# EAGLE schematic PX4FMUv1.7 (EAGLE 6.2)

## Sheet 1 of 3
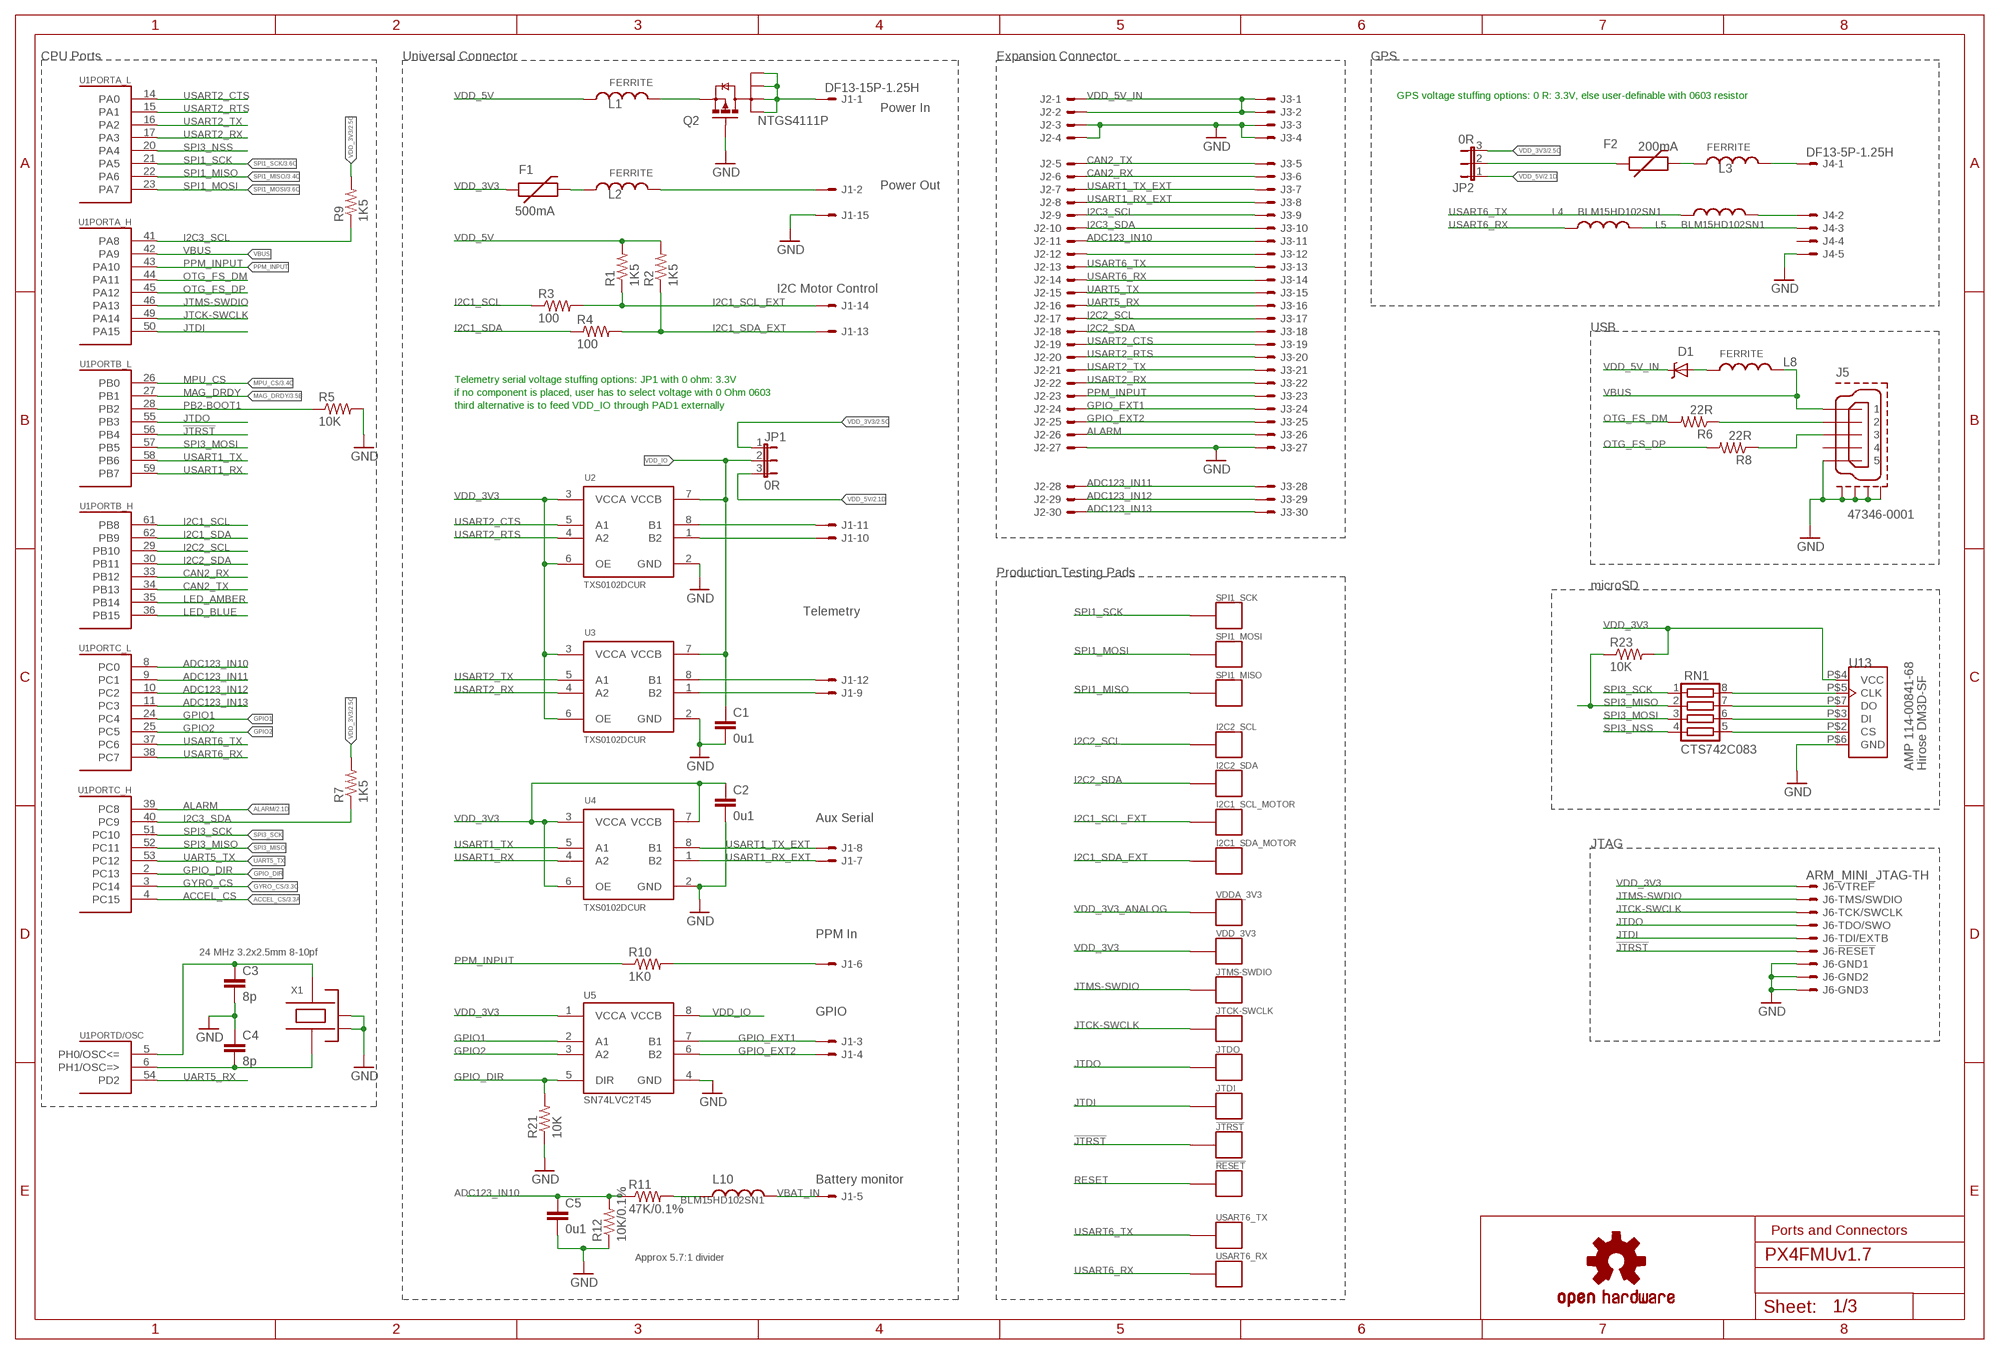
[diagram p0: schematic, sheet 1]

### Parts
!JTRST  PAD.04  [PAD.04X.04]
!RESET  PAD.04  [PAD.04X.04]
C1  0u1  CAP0402-CAP  [0402-CAP]
C2  0u1  CAP0402-CAP  [0402-CAP]
C3  8p  CAP0402-CAP  [0402-CAP]
C4  8p  CAP0402-CAP  [0402-CAP]
C5  0u1  CAP0402-CAP  [0402-CAP]
D1  MSS1P4-M3  DIODE-SCHOTTKY_MSMP  [MICROSMP]
F1  500mA  PTC0402  [0402-PTC]
F2  200mA  PTC0402  [0402-PTC]
I2C1_SCL_MOTOR  PAD.03  [PAD.03X.03]
I2C1_SDA_MOTOR  PAD.03  [PAD.03X.03]
I2C2_SCL  PAD.03  [PAD.03X.03]
I2C2_SDA  PAD.04  [PAD.04X.04]
J1  DF13-15P-1.25H  [DF13A-15P-1.25H]
J2  HEADER_2X15-REV  [HEADER_2MM_2X15_REVERSE]
J3  HEADER_2X15  HEADER_2X15-SMD  [HEADER_2MM_2X15]
J4  DF13-5P-1.25H  [DF13A-5P-1.25H]
J5  47346-0001  MOLEX-47346-0001  [MOLEX-47346-0001]
J6  ARM_MINI_JTAG-TH  [FTSH-105-01-XXX-DV]
JP1  0R  JUMPER-30603  [SJ_3_0603_PASTE1&2]
JP2  0R  JUMPER-30603  [SJ_3_0603_PASTE1&2]
JTCK-SWCLK  PAD.04  [PAD.04X.04]
JTDI  PAD.04  [PAD.04X.04]
JTDO  PAD.04  [PAD.04X.04]
JTMS-SWDIO  PAD.04  [PAD.04X.04]
L1  FERRITE  INDUCTOR0402  [0402-IND]
L2  FERRITE  INDUCTOR0402  [0402-IND]
L3  FERRITE  INDUCTOR0402  [0402-IND]
L4  BLM15HD102SN1  INDUCTOR0402  [0402-IND]
L5  BLM15HD102SN1  INDUCTOR0402  [0402-IND]
L8  FERRITE  INDUCTOR0402  [0402-IND]
L10  BLM15HD102SN1  INDUCTOR0402  [0402-IND]
Q2  NTGS4111P  [TSOP-6]
R1  1K5  RESISTOR0402-RES  [0402-RES]
R2  1K5  RESISTOR0402-RES  [0402-RES]
R3  100  RESISTOR0402-RES  [0402-RES]
R4  100  RESISTOR0402-RES  [0402-RES]
R5  10K  RESISTOR0402-RES  [0402-RES]
R6  22R  RESISTOR0402-RES  [0402-RES]
R7  1K5  RESISTOR0402-RES  [0402-RES]
R8  22R  RESISTOR0402-RES  [0402-RES]
R9  1K5  RESISTOR0402-RES  [0402-RES]
R10  1K0  RESISTOR0402-RES  [0402-RES]
R11  47K/0.1%  RESISTOR0402-RES  [0402-RES]
R12  10K/0.1%  RESISTOR0402-RES  [0402-RES]
R21  10K  RESISTOR0402-RES  [0402-RES]
R23  10K  RESISTOR0402-RES  [0402-RES]
RN1  CTS742C083  [CTS742C083]
SPI1_MISO  PAD.04  [PAD.04X.04]
SPI1_MOSI  PAD.04  [PAD.04X.04]
SPI1_SCK  PAD.04  [PAD.04X.04]
U1  STM32F405RGT6  STM32F20X_TQFP64  [TQFP64]
U2  TXS0102DCUR  [TI-DCU]
U3  TXS0102DCUR  [TI-DCU]
U4  TXS0102DCUR  [TI-DCU]
U5  SN74LVC2T45  SN74LVC2T45DCUR  [TI-DCU]
U13  AMP 114-00841-68  SF-MICROSDAMP-114-00841-68  [AMPHENOL_114-00841-68]
U$7  OSHW-LOGOS  [OSHW-LOGO-S]
USART6_RX  PAD.04  [PAD.04X.04]
USART6_TX  PAD.04  [PAD.04X.04]
VDD_3V3  PAD.04  [PAD.04X.04]
VDDA_3V3  PAD.04  [PAD.04X.04]
X1  24 MHz 3.2x2.5mm 8-10pf  OSCILLATOR-3.2X2.5  [OSCILLATOR-3.2X2.5]

### Nets
!JTRST: !JTRST.P$1 J6.10 U1.56(PORTB_L:PB4)
ACCEL_CS: U1.4(PORTC_H:PC15) ; also sheet 3
ADC123_IN10: C5.1 J2.11 J3.11 R11.1 R12.2 U1.8(PORTC_L:PC0)
ADC123_IN11: J2.28 J3.28 U1.9(PORTC_L:PC1)
ADC123_IN12: J2.29 J3.29 U1.10(PORTC_L:PC2)
ADC123_IN13: J2.30 J3.30 U1.11(PORTC_L:PC3) ; also sheet 3
ALARM: J2.26 J3.26 U1.39(PORTC_H:PC8) ; also sheet 2
CAN2_RX: J2.6 J3.6 U1.33(PORTB_H:PB12)
CAN2_TX: J2.5 J3.5 U1.34(PORTB_H:PB13)
GND [power]: C1.2 C2.2 C3.2 C4.1 C5.2 J1.15 J2.3 J2.4 J2.27 J3.3 J3.4 J3.27 J4.5 J5.GND J5.GND1 J5.GND2 J5.GND3 J5.GND4 J6.3 J6.5 J6.9 Q2.3(G) R5.2 R12.1 R21.1 U2.2(GND) U3.2(GND) U4.2(GND) U5.4(GND) U13.P$6(GND) X1.2(NC_2) X1.4(NC_4) ; also sheet 2,3
GPIO1: U1.24(PORTC_L:PC4) U5.2(A1)
GPIO2: U1.25(PORTC_L:PC5) U5.3(A2)
GPIO_DIR: R21.2 U1.2(PORTC_H:PC13) U5.5(DIR)
GPIO_EXT1: J1.3 J2.24 J3.24 U5.7(B1)
GPIO_EXT2: J1.4 J2.25 J3.25 U5.6(B2)
GYRO_CS: U1.3(PORTC_H:PC14) ; also sheet 3
I2C1_SCL: R3.1 U1.61(PORTB_H:PB8)
I2C1_SCL_EXT: I2C1_SCL_MOTOR.P$1 J1.14 R1.1 R3.2
I2C1_SDA: R4.1 U1.62(PORTB_H:PB9)
I2C1_SDA_EXT: I2C1_SDA_MOTOR.P$1 J1.13 R2.1 R4.2
I2C2_SCL: I2C2_SCL.P$1 J2.17 J3.17 U1.29(PORTB_H:PB10) ; also sheet 2,3
I2C2_SDA: I2C2_SDA.P$1 J2.18 J3.18 U1.30(PORTB_H:PB11) ; also sheet 2,3
I2C3_SCL: J2.9 J3.9 R9.1 U1.41(PORTA_H:PA8)
I2C3_SDA: J2.10 J3.10 R7.1 U1.40(PORTC_H:PC9)
JTCK-SWCLK: J6.4 JTCK-SWCLK.P$1 U1.49(PORTA_H:PA14)
JTDI: J6.8 JTDI.P$1 U1.50(PORTA_H:PA15)
JTDO: J6.6 JTDO.P$1 U1.55(PORTB_L:PB3)
JTMS-SWDIO: J6.2 JTMS-SWDIO.P$1 U1.46(PORTA_H:PA13)
LED_AMBER: U1.35(PORTB_H:PB14) ; also sheet 2
LED_BLUE: U1.36(PORTB_H:PB15) ; also sheet 2
MAG_DRDY: U1.27(PORTB_L:PB1) ; also sheet 3
MPU_CS: U1.26(PORTB_L:PB0) ; also sheet 3
N$1: C4.2 U1.6(PORTD/OSC:PH1/OSC=>) X1.1
N$2: C3.1 U1.5(PORTD/OSC:PH0/OSC<=) X1.3
N$3: J1.2 L2.2
N$5: F2.2 L3.1
N$8: J4.2 L5.2
N$11: J4.3 L4.2
N$12: J1.11 U2.8(B1)
N$13: J1.10 U2.1(B2)
N$14: L1.2 Q2.4(S)
N$15: J1.12 U3.8(B1)
N$16: J1.9 U3.1(B2)
N$18: F2.1 JP2.2
N$20: J2.12 J3.12
N$21: RN1.5 U13.P$2(CS)
N$23 [power]: D1.ANODE(A) L8.1
N$24 [power]: J4.1 L3.2
N$26: RN1.6 U13.P$3(DI)
N$27 [power]: F1.2 L2.1
N$31: RN1.7 U13.P$7(DO)
N$32: RN1.8 U13.P$5(CLK)
N$35: L10.1 R11.2
N$41: J1.1 Q2.1(D) Q2.2(D1) Q2.5(D2) Q2.6(D3)
OTG_DM: J5.D- R6.1
OTG_DP: J5.D+ R8.1
OTG_FS_DM: R6.2 U1.44(PORTA_H:PA11)
OTG_FS_DP: R8.2 U1.45(PORTA_H:PA12)
PB2-BOOT1: R5.1 U1.28(PORTB_L:PB2)
PPM_INPUT: J2.23 J3.23 R10.1 U1.43(PORTA_H:PA10)
PPM_INPUT_CON: J1.6 R10.2
RESET: !RESET.P$1 ; also sheet 2
SPI1_MISO: SPI1_MISO.P$1 U1.22(PORTA_L:PA6) ; also sheet 3
SPI1_MOSI: SPI1_MOSI.P$1 U1.23(PORTA_L:PA7) ; also sheet 3
SPI1_SCK: SPI1_SCK.P$1 U1.21(PORTA_L:PA5) ; also sheet 3
SPI3_MISO: R23.1 RN1.2 U1.52(PORTC_H:PC11)
SPI3_MOSI: RN1.3 U1.57(PORTB_L:PB5)
SPI3_NSS: RN1.4 U1.20(PORTA_L:PA4)
SPI3_SCK: RN1.1 U1.51(PORTC_H:PC10)
UART5_RX: J2.16 J3.16 U1.54(PORTD/OSC:PD2)
UART5_TX: J2.15 J3.15 U1.53(PORTC_H:PC12)
USART1_RX: U1.59(PORTB_L:PB7) U4.4(A2)
USART1_RX_EXT: J1.7 J2.8 J3.8 U4.1(B2)
USART1_TX: U1.58(PORTB_L:PB6) U4.5(A1)
USART1_TX_EXT: J1.8 J2.7 J3.7 U4.8(B1)
USART2_CTS: J2.19 J3.19 U1.14(PORTA_L:PA0) U2.5(A1)
USART2_RTS: J2.20 J3.20 U1.15(PORTA_L:PA1) U2.4(A2)
USART2_RX: J2.22 J3.22 U1.17(PORTA_L:PA3) U3.4(A2)
USART2_TX: J2.21 J3.21 U1.16(PORTA_L:PA2) U3.5(A1)
USART6_RX: J2.14 J3.14 L4.1 U1.38(PORTC_L:PC7) USART6_RX.P$1
USART6_TX: J2.13 J3.13 L5.1 U1.37(PORTC_L:PC6) USART6_TX.P$1
VBAT_IN: J1.5 L10.2 ; also sheet 2
VBUS [power]: J5.VBUS L8.2 U1.42(PORTA_H:PA9)
VDD_3V3 [power]: C2.1 F1.1 J6.1 JP1.1 JP2.3 R7.2 R9.2 R23.2 U2.3(VCCA) U2.6(OE) U3.3(VCCA) U3.6(OE) U4.3(VCCA) U4.6(OE) U4.7(VCCB) U5.1(VCCA) U13.P$4(VCC) VDD_3V3.P$1 ; also sheet 2,3
VDD_3V3_ANALOG [power]: VDDA_3V3.P$1 ; also sheet 2,3
VDD_5V [power]: JP1.3 JP2.1 L1.1 R1.2 R2.2 ; also sheet 2
VDD_5V_IN [power]: D1.CATHODE(C) J2.1 J2.2 J3.1 J3.2 ; also sheet 2
VDD_IO [power]: C1.1 JP1.2 U2.7(VCCB) U3.7(VCCB) U5.8(VCCB)
Unconnected: J4.4 J5.ID

### Notes on the sheet
- CPU Ports | Universal Connector | Expansion Connector | GPS
- GPS voltage stuffing options: 0 R: 3.3V, else user-definable with 0603 resistor
- Power In
- Power Out
- I2C Motor Control
- USB
- Telemetry serial voltage stuffing options: JP1 with 0 ohm: 3.3V
- if no component is placed, user has to select voltage with 0 Ohm 0603
- third alternative is to feed VDD_IO through PAD1 externally
- Production Testing Pads
- microSD
- Telemetry
- Hirose DM3D-SF
- Aux Serial
- JTAG
- PPM In
- GPIO
- Battery monitor
- Ports and Connectors
- Approx 5.7:1 divider

## Sheet 2 of 3
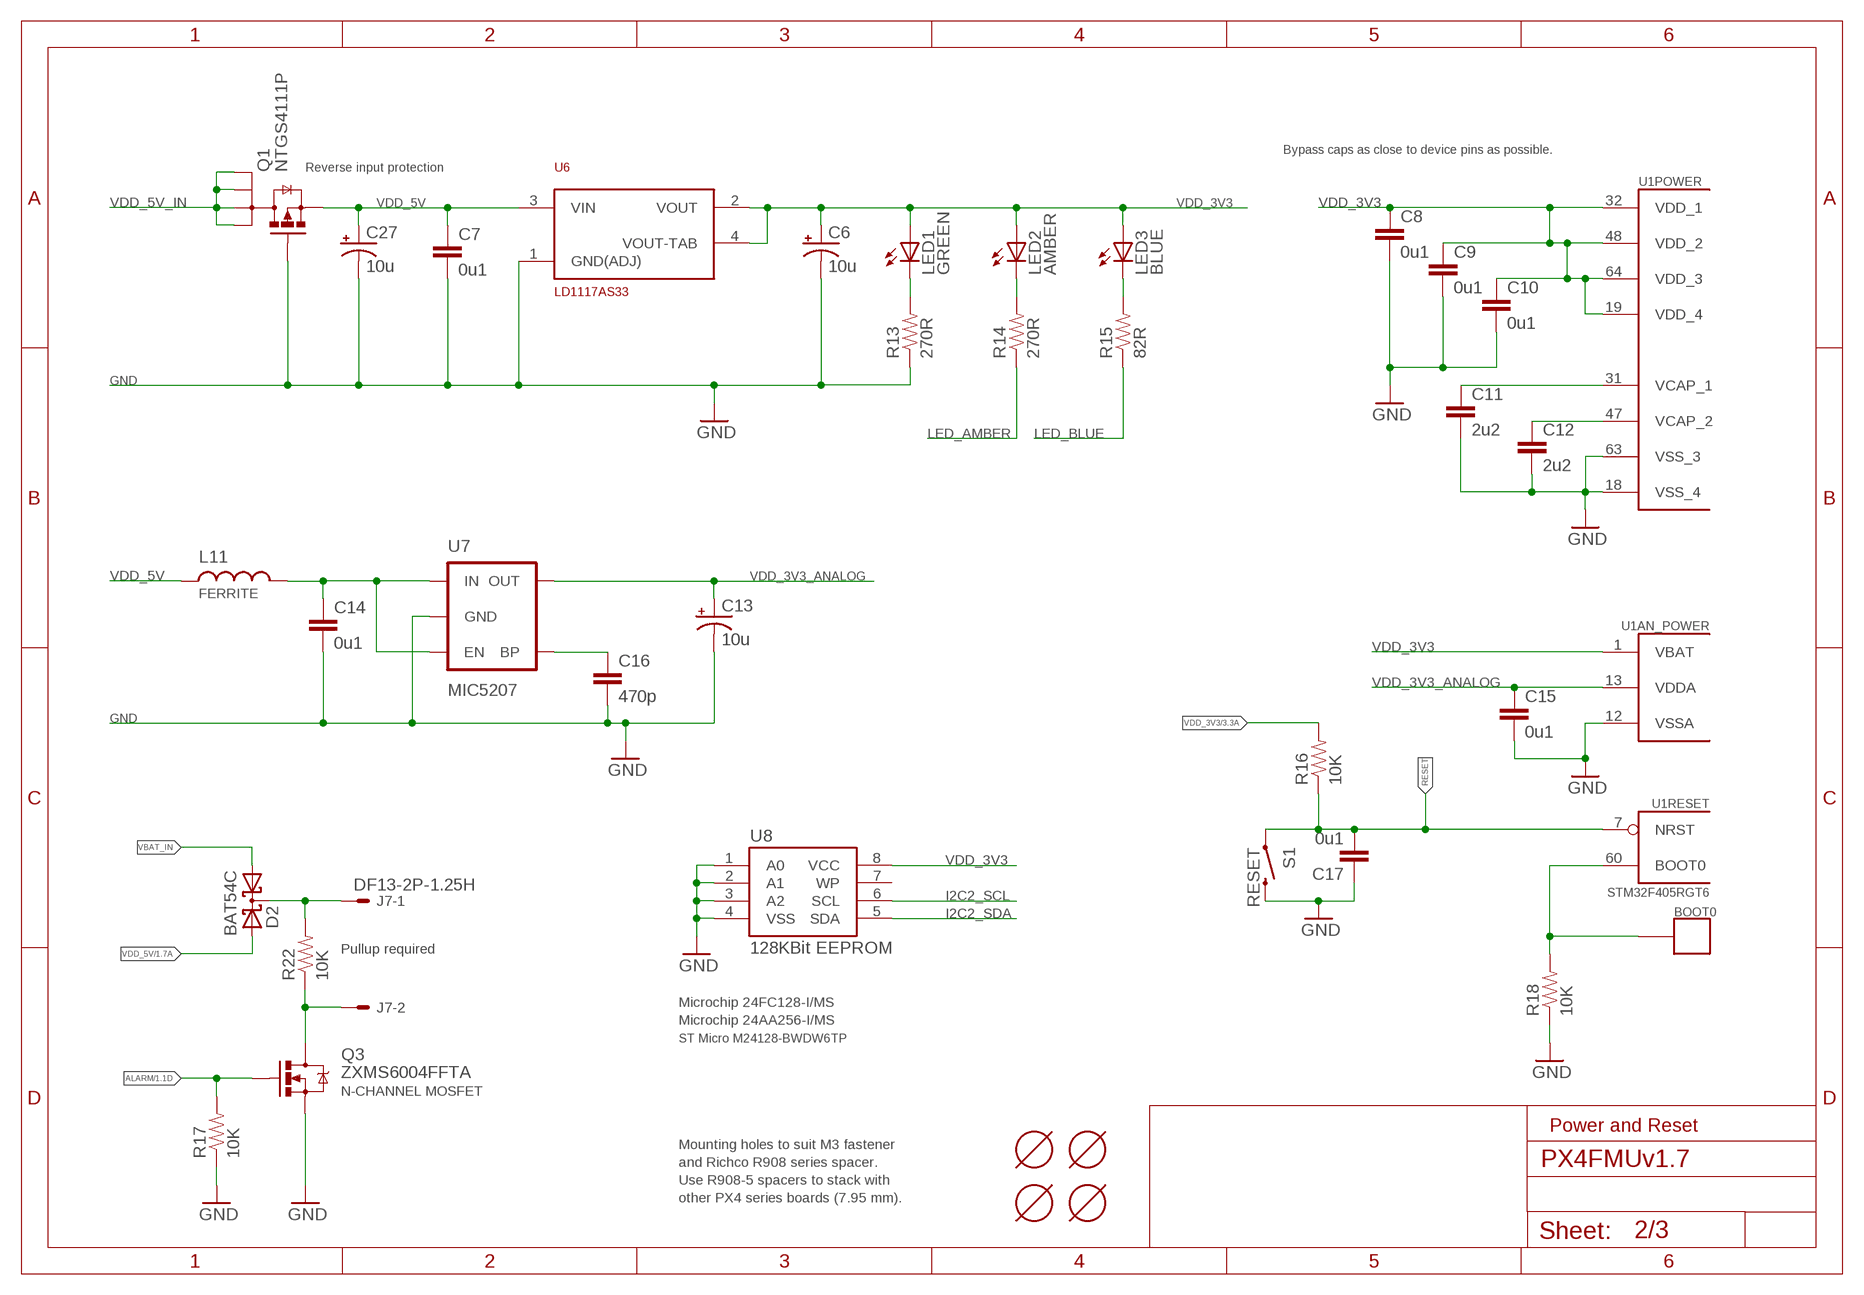
[diagram p1: schematic, sheet 2]

### Parts
BOOT0  PAD.04  [PAD.04X.04]
C6  10u  CAP_POL1206  [EIA3216]
C7  0u1  CAP0402-CAP  [0402-CAP]
C8  0u1  CAP0402-CAP  [0402-CAP]
C9  0u1  CAP0402-CAP  [0402-CAP]
C10  0u1  CAP0402-CAP  [0402-CAP]
C11  2u2  CAP0402-CAP  [0402-CAP]
C12  2u2  CAP0402-CAP  [0402-CAP]
C13  10u  CAP_POL1206  [EIA3216]
C14  0u1  CAP0402-CAP  [0402-CAP]
C15  0u1  CAP0402-CAP  [0402-CAP]
C16  470p  CAP0402-CAP  [0402-CAP]
C17  0u1  CAP0402-CAP  [0402-CAP]
C27  10u  CAP_POL1206  [EIA3216]
D2  BAT54C  [SOT23-3]
J7  DF13-2P-1.25H  [DF13A-2P-1.25H]
L11  FERRITE  INDUCTOR0402  [0402-IND]
LED1  GREEN  LED0603  [LED-0603]
LED2  AMBER  LED0603  [LED-0603]
LED3  BLUE  LED0603  [LED-0603]
Q1  NTGS4111P  [TSOP-6]
Q3  ZXMS6004FFTA  MOSFET-NCHANNELSMD  [SOT23-3]
R13  270R  RESISTOR0402-RES  [0402-RES]
R14  270R  RESISTOR0402-RES  [0402-RES]
R15  82R  RESISTOR0402-RES  [0402-RES]
R16  10K  RESISTOR0402-RES  [0402-RES]
R17  10K  RESISTOR0402-RES  [0402-RES]
R18  10K  RESISTOR0402-RES  [0402-RES]
R22  10K  RESISTOR0402-RES  [0402-RES]
S1  RESET  SWITCH-MOMENTARY-2  [EVQP7J01K]
U6  LD1117AS33  [SOT-223]
U7  MIC5207  V_REG_LDOSMD  [SOT23-5]
U8  128KBit EEPROM  EEPROM-I2CMSOP  [MSOP-8]
U$1  MOUNT-HOLE3.1MM  [MOUNT-HOLE3.1]
U$2  MOUNT-HOLE3.1MM  [MOUNT-HOLE3.1]
U$3  MOUNT-HOLE3.1MM  [MOUNT-HOLE3.1]
U$4  MOUNT-HOLE3.1MM  [MOUNT-HOLE3.1]

### Nets
ALARM: Q3.1(G) R17.2 ; also sheet 1
BOOT0: BOOT0.P$1 R18.2 U1.60(RESET:BOOT0)
GND [power]: C6.C(-) C7.2 C8.2 C9.2 C10.2 C11.2 C12.2 C13.C(-) C14.2 C15.2 C16.2 C17.1 C27.C(-) Q1.3(G) Q3.2(S) R13.1 R17.1 R18.1 S1.B3 U1.12(AN_POWER:VSSA) U1.18(POWER:VSS_4) U1.63(POWER:VSS_3) U6.1(GND(ADJ)) U7.2(GND) U8.1(A0) U8.2(A1) U8.3(A2) U8.4(VSS) ; also sheet 1,3
I2C2_SCL: U8.6(SCL) ; also sheet 1,3
I2C2_SDA: U8.5(SDA) ; also sheet 1,3
LED_AMBER: R14.1 ; also sheet 1
LED_BLUE: R15.1 ; also sheet 1
N$4: D2.3(CC) J7.1 R22.2
N$9: C16.1 U7.4(BP)
N$25: J7.2 Q3.3(D) R22.1
N$28: LED3.C R15.2
N$29: LED1.C R13.2
N$30: LED2.C R14.2
N$100 [power]: C14.1 L11.2 U7.1(IN) U7.3(EN)
RESET: C17.2 R16.1 S1.A1 U1.7(RESET:NRST) ; also sheet 1
VBAT_IN: D2.1(A1) ; also sheet 1
VCAP_1: C11.1 U1.31(POWER:VCAP_1)
VCAP_2: C12.1 U1.47(POWER:VCAP_2)
VDD_3V3 [power]: C6.A(+) C8.1 C9.1 C10.1 LED1.A LED2.A LED3.A R16.2 U1.1(AN_POWER:VBAT) U1.19(POWER:VDD_4) U1.32(POWER:VDD_1) U1.48(POWER:VDD_2) U1.64(POWER:VDD_3) U6.2(VOUT) U6.4(VOUT-TAB) U8.8(VCC) ; also sheet 1,3
VDD_3V3_ANALOG [power]: C13.A(+) C15.1 U1.13(AN_POWER:VDDA) U7.5(OUT) ; also sheet 1,3
VDD_5V [power]: C7.1 C27.A(+) D2.2(A2) L11.1 Q1.4(S) U6.3(VIN) ; also sheet 1
VDD_5V_IN [power]: Q1.1(D) Q1.2(D1) Q1.5(D2) Q1.6(D3) ; also sheet 1
Unconnected: U8.7(WP)

### Notes on the sheet
- Bypass caps as close to device pins as possible.
- Reverse input protection
- Pullup required
- Microchip 24FC128-I/MS
- Microchip 24AA256-I/MS
- ST Micro M24128-BWDW6TP
- N-CHANNEL MOSFET
- Power and Reset
- Mounting holes to suit M3 fastener
- and Richco R908 series spacer.
- Use R908-5 spacers to stack with
- other PX4 series boards (7.95 mm).

## Sheet 3 of 3
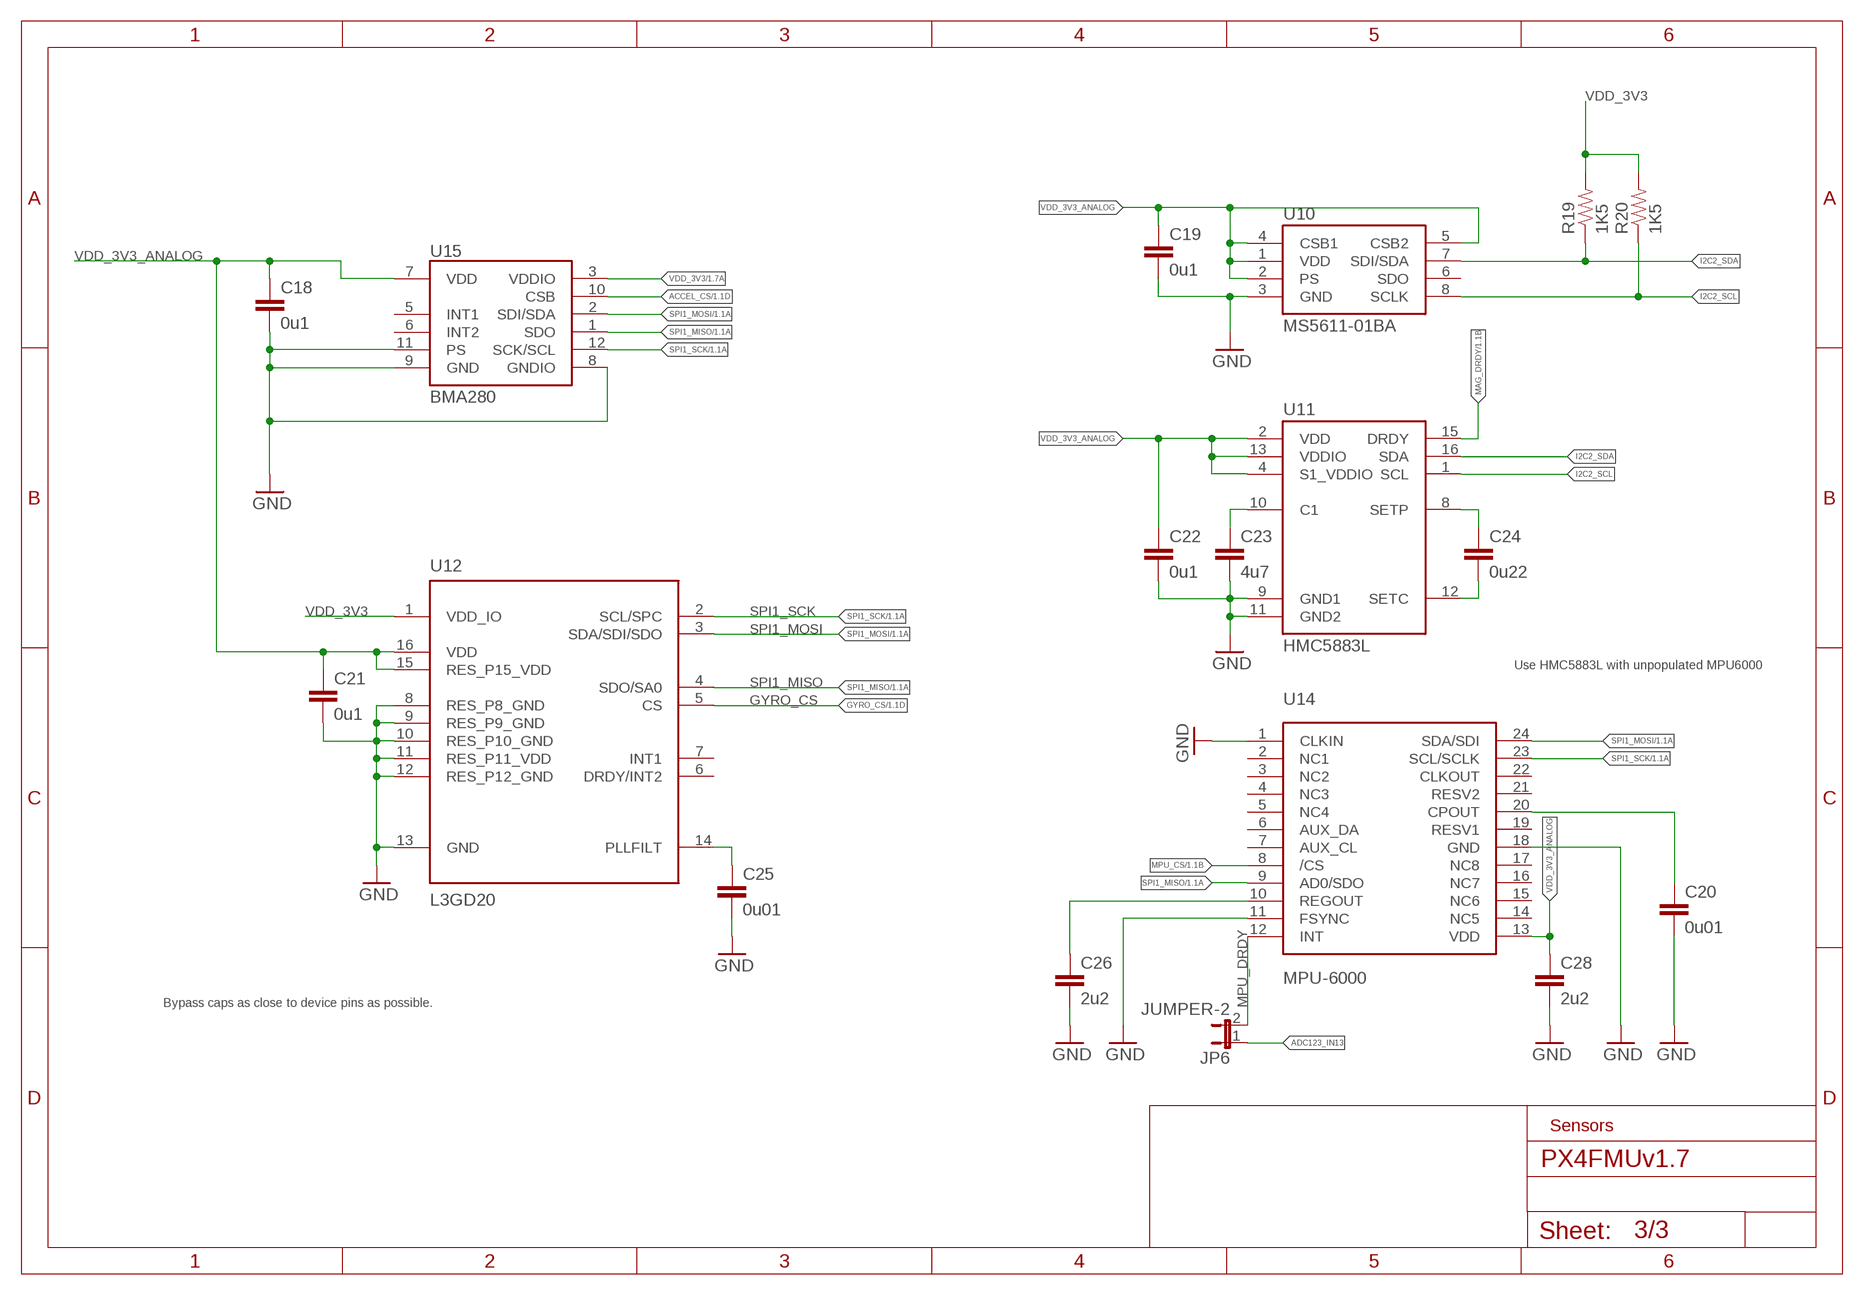
[diagram p2: schematic, sheet 3]

### Parts
C18  0u1  CAP0402-CAP  [0402-CAP]
C19  0u1  CAP0402-CAP  [0402-CAP]
C20  0u01  CAP0402-CAP  [0402-CAP]
C21  0u1  CAP0402-CAP  [0402-CAP]
C22  0u1  CAP0402-CAP  [0402-CAP]
C23  4u7  CAP0402-CAP  [0402-CAP]
C24  0u22  CAP0402-CAP  [0402-CAP]
C25  0u01  CAP0402-CAP  [0402-CAP]
C26  2u2  CAP0402-CAP  [0402-CAP]
C28  2u2  CAP0402-CAP  [0402-CAP]
JP6  JUMPER-2  [SJ_2]
R19  1K5  RESISTOR0402-RES  [0402-RES]
R20  1K5  RESISTOR0402-RES  [0402-RES]
U10  MS5611-01BA  [MS5611-01BA]
U11  HMC5883L  [HMC5883L-MAN]
U12  L3GD20  L3G4200DH-LL  [L3G4200DH-MAN]
U14  MPU-6000  [QFN-24]
U15  BMA280  [BMA280]

### Nets
ACCEL_CS: U15.10(CSB) ; also sheet 1
ADC123_IN13: JP6.1 ; also sheet 1
GND [power]: C18.2 C19.2 C20.2 C21.2 C22.2 C23.2 C25.2 C26.2 C28.2 U10.3(GND) U11.9(GND1) U11.11(GND2) U12.8(RES_P8_GND) U12.9(RES_P9_GND) U12.10(RES_P10_GND) U12.11(RES_P11_VDD) U12.12(RES_P12_GND) U12.13(GND) U14.1(CLKIN) U14.11(FSYNC) U14.18(GND) U15.8(GNDIO) U15.9(GND) U15.11(PS) ; also sheet 1,2
GYRO_CS: U12.5(CS) ; also sheet 1
I2C2_SCL: R20.1 U10.8(SCLK) U11.1(SCL) ; also sheet 1,2
I2C2_SDA: R19.1 U10.7(SDI/SDA) U11.16(SDA) ; also sheet 1,2
MAG_DRDY: U11.15(DRDY) ; also sheet 1
MPU_CS: U14.8(/CS) ; also sheet 1
N$10: C24.1 U11.8(SETP)
N$17: C24.2 U11.12(SETC)
N$34: C25.1 U12.14(PLLFILT)
N$36: C23.1 U11.10(C1)
N$40: C20.1 U14.20(CPOUT)
N$42: C26.1 U14.10(REGOUT)
N$44: JP6.2 U14.12(INT)
SPI1_MISO: U12.4(SDO/SA0) U14.9(AD0/SDO) U15.1(SDO) ; also sheet 1
SPI1_MOSI: U12.3(SDA/SDI/SDO) U14.24(SDA/SDI) U15.2(SDI/SDA) ; also sheet 1
SPI1_SCK: U12.2(SCL/SPC) U14.23(SCL/SCLK) U15.12(SCK/SCL) ; also sheet 1
VDD_3V3 [power]: R19.2 R20.2 U12.1(VDD_IO) U15.3(VDDIO) ; also sheet 1,2
VDD_3V3_ANALOG [power]: C18.1 C19.1 C21.1 C22.1 C28.1 U10.1(VDD) U10.2(PS) U10.4(CSB1) U10.5(CSB2) U11.2(VDD) U11.4(S1_VDDIO) U11.13(VDDIO) U12.15(RES_P15_VDD) U12.16(VDD) U14.13(VDD) U15.7(VDD) ; also sheet 1,2
Unconnected: U10.6(SDO) U11.3(NC_P3) U11.5(NC_P5) U11.6(NC_P6) U11.7(NC_P7) U11.14(NC_P14) U12.6(DRDY/INT2) U12.7(INT1) U14.2(NC1) U14.3(NC2) U14.4(NC3) U14.5(NC4) U14.6(AUX_DA) U14.7(AUX_CL) U14.14(NC5) U14.15(NC6) U14.16(NC7) U14.17(NC8) U14.19(RESV1) U14.21(RESV2) U14.22(CLKOUT) U15.5(INT1) U15.6(INT2)

### Notes on the sheet
- Use HMC5883L with unpopulated MPU6000
- Bypass caps as close to device pins as possible. | MPU_DRDY
- Sensors

## Library data of the parts
!JTRST !RESET BOOT0 I2C1_SCL_MOTOR I2C1_SDA_MOTOR I2C2_SCL I2C2_SDA JTCK-SWCLK JTDI JTDO JTMS-SWDIO SPI1_MISO SPI1_MOSI SPI1_SCK USART6_RX USART6_TX VDD_3V3 VDDA_3V3 = pixhawk2:PAD: Test pad This footprint includes three classes: The actual test pads, a pogo-pin footprint to mount the pogo-pin as through-hole part and a hole footprint which allows the head of the pogo-pin to pass through (do NOT use the hole to mount the pogo-pin). In a typical test setup, the stack would consist of three PCBs: The actual PCB under testing with a test pad on the bottom, then a second PCB with the hole for the pogo-pin head where the PCB under testing is pressed on and a third PCB at 30 mm / 1.2" distance with the pogo-pin footprints. The pogo-pins are soldered to the last PCB. To create the stack, copy the board under testing and exchange the footprints - this way the correct positioning is ensured.; BOM: EXCLUDE; PARTNO: *
C1 C2 C5 C7-C10 C14 C15 C17-C19 C21 C22 = pixhawk2:CAP: Capacitor Standard 0603 ceramic capacitor, and 0.1" leaded capacitor.; PARTNO: CC0402ZRY5V7BB104
C3 C4 = pixhawk2:CAP: Capacitor Standard 0603 ceramic capacitor, and 0.1" leaded capacitor.; PARTNO: C1005C0G1H080C
C6 C13 C27 = pixhawk2:CAP_POL: Capacitor Polarized These are standard SMD and PTH capacitors. Normally 10uF, 47uF, and 100uF in electrolytic and tantalum varieties. Always verify the external diameter of the through hole cap, it varies with capacity, voltage, and manufacturer. The EIA devices should be standard.; PARTNO: F931A106MAA
C11 C12 C26 C28 = pixhawk2:CAP: Capacitor Standard 0603 ceramic capacitor, and 0.1" leaded capacitor.; PARTNO: C1608Y5V1C225Z
C16 = pixhawk2:CAP: Capacitor Standard 0603 ceramic capacitor, and 0.1" leaded capacitor.; PARTNO: CC0402KRX7R9BB471
C20 C25 = pixhawk2:CAP: Capacitor Standard 0603 ceramic capacitor, and 0.1" leaded capacitor.; PARTNO: CC0402KRX7R7BB103
C23 = pixhawk2:CAP: Capacitor Standard 0603 ceramic capacitor, and 0.1" leaded capacitor.; PARTNO: C1608Y5V0J475Z
C24 = pixhawk2:CAP: Capacitor Standard 0603 ceramic capacitor, and 0.1" leaded capacitor.; PARTNO: C1005Y5V1C224Z
D1 = pixhawk2:DIODE-SCHOTTKY: Schottky barrier diode in DO214AC, e.g. Fairchild SS14.; PARTNO: MSS1P4-M3/89A
D2 = pixhawk2:BAT54C: Schottky Diodes Source: Fairchild .. BAT54.pdf; PARTNO: BAT54C-7-F
F1 = pixhawk2:PTC: Resettable Fuse PTC Resettable Fuse. Spark Fun Electronics SKU : COM-08357; PARTNO: MF-FSMF050X-2
F2 = pixhawk2:PTC: Resettable Fuse PTC Resettable Fuse. Spark Fun Electronics SKU : COM-08357; PARTNO: MF-FSMF020X-2
J1 = pixhawk2:DF13-15P-1.25?; PARTNO: DF13A-15P-1.25H(20)
J2 = pixhawk2:HEADER_2X15: 2X15 header; BOM: EXCLUDE; PARTNO: 953230-2000-AR-PR
J3 = pixhawk2:HEADER_2X15: 2X15 header; PARTNO: 953230-2000-AR-PR
J4 = pixhawk2:DF13-5P-1.25?; PARTNO: DF13A-5P-1.25H(20)
J5 = pixhawk2:MOLEX-47346-0001: MICRO USB B, BOTTOM MOUNT; PARTNO: 47346-0001
J6 = pixhawk2:ARM_MINI_JTAG: CONNECTOR wire to board 1.25 mm (.049 inch) pitch header; PARTNO: M50-3900542
J7 = pixhawk2:DF13-2P-1.25?; PARTNO: DF13-2P-1.25H(20)
JP1 JP2 = pixhawk2:JUMPER-3; PARTNO: RMCF0402ZT0R00
JP6 = pixhawk2:JUMPER-2; BOM: EXCLUDE
L1-L3 L8 L11 = pixhawk2:INDUCTOR: Inductors Basic Inductor/Choke - 0603 and 1206. Footprints are not proven and vary greatly between part numbers.; PARTNO: BKP1005HS121-T
L4 L5 L10 = pixhawk2:INDUCTOR: Inductors Basic Inductor/Choke - 0603 and 1206. Footprints are not proven and vary greatly between part numbers.; PARTNO: BLM15HD102SN1
LED1 = pixhawk2:LED: LEDs Standard schematic elements and footprints for 5mm, 3mm, 1206, and 0603 sized LEDs. 5mm - Spark Fun Electronics SKU : COM-00529 (and others); PARTNO: LNJ337W83RA
LED2 = pixhawk2:LED: LEDs Standard schematic elements and footprints for 5mm, 3mm, 1206, and 0603 sized LEDs. 5mm - Spark Fun Electronics SKU : COM-00529 (and others); PARTNO: LNJ437W84RA
LED3 = pixhawk2:LED: LEDs Standard schematic elements and footprints for 5mm, 3mm, 1206, and 0603 sized LEDs. 5mm - Spark Fun Electronics SKU : COM-00529 (and others); PARTNO: LNJ937W8CRA
Q1 Q2 = pixhawk2:NTGS4111P; PARTNO: NTGS4111P
Q3 = pixhawk2:MOSFET-NCHANNEL; PARTNO: ZXMS6004FFTA
R1 R2 R7 R9 R19 R20 = pixhawk2:RESISTOR: Resistor Basic schematic elements and footprints for 0603, 1206, and PTH 1/10th watt (small) resistors.; PARTNO: RMCF0402JT1K50
R3 R4 = pixhawk2:RESISTOR: Resistor Basic schematic elements and footprints for 0603, 1206, and PTH 1/10th watt (small) resistors.; PARTNO: RMCF0402JT100R
R5 R16-R18 R21-R23 = pixhawk2:RESISTOR: Resistor Basic schematic elements and footprints for 0603, 1206, and PTH 1/10th watt (small) resistors.; PARTNO: RMCF0402FT10K0
R6 R8 = pixhawk2:RESISTOR: Resistor Basic schematic elements and footprints for 0603, 1206, and PTH 1/10th watt (small) resistors.; PARTNO: RMCF0402JT22R0
R10 = pixhawk2:RESISTOR: Resistor Basic schematic elements and footprints for 0603, 1206, and PTH 1/10th watt (small) resistors.; PARTNO: RMCF0402JT1K00
R11 = pixhawk2:RESISTOR: Resistor Basic schematic elements and footprints for 0603, 1206, and PTH 1/10th watt (small) resistors.; PARTNO: ERA-2AEB473X
R12 = pixhawk2:RESISTOR: Resistor Basic schematic elements and footprints for 0603, 1206, and PTH 1/10th watt (small) resistors.; PARTNO: ERA-2AEB103X
R13 R14 = pixhawk2:RESISTOR: Resistor Basic schematic elements and footprints for 0603, 1206, and PTH 1/10th watt (small) resistors.; PARTNO: RC0402JR-07270RL
R15 = pixhawk2:RESISTOR: Resistor Basic schematic elements and footprints for 0603, 1206, and PTH 1/10th watt (small) resistors.; PARTNO: RC0402JR-0782RL
RN1 = pixhawk2:CTS742C083: Chip Resistor Array 4 Single Resistor Source: http://www.ctscorp.com/components/Datasheets/CTSChipArrayDs.pdf; OC_FARNELL: unknown; OC_NEWARK: unknown; PARTNO: TC164-JR-07100RL
S1 = pixhawk2:SWITCH-MOMENTARY-2; PARTNO: EVQP7J01K
U1 = pixhawk2:STM32F20X_TQFP64: STM32F20x 64pin LQFP; PARTNO: STM32F405RGT6
U2-U4 = pixhawk2:TXS0102: TI TXS0102 Level Shifter Auto-sensing level shifter, e.g. for I2C or UART.; PARTNO: TXS0102DCUR
U5 = pixhawk2:SN74LVC2T45: DUAL-BIT DUAL-SUPPLY BUS TRANSCEIVER WITH CONFIGURABLE VOLTAGE TRANSLATION AND 3-STATE OUTPUTS; PARTNO: SN74LVC2T45
U6 = pixhawk2:LD1117A: LD1117A LDO Datasheet: http://www.st.com/stonline/books/pdf/docs/7194.pdf; PARTNO: LD1117AS33
U7 = pixhawk2:V_REG_LDO: Voltage Regulator LDO Standard 150mA LDO voltage regulator in SOT-23 layout. Micrel part MIC5205. BP (by-pass) pin is used to lower output noise with 470pF cap.; PARTNO: MIC5207-3.3YM5
U8 = pixhawk2:EEPROM-I2C: I2C EEPROM Generic footprint for I2C EEPROMS. Compatible types include: Microchip 24FC128-I/MS Microchip 24AA256-I/MS ST Microelectronics M24128-BWDW6TP; PARTNO: 24FC128-I/MS
U10 = pixhawk2:MS5611-01BA: MS5611-01BA The MS5611-01BA is a new generation of high resolution altimeter sensors from MEAS Switzerland with SPI and I 2 C bus interface. It is optimized for altimeters and variometers with an altitude resolution of 10 cm. The sensor module includes a high linearity pressure sensor and an ultra low power 24 bit ?? ADC with internal factory calibrated coefficients. It provides a precise digital 24 Bit pressure and temperature value and different operation modes that allow the user to optimize for conversion speed and current consumption. A high resolution temperature output allows the implementation of an altimeter/thermometer function without any additional sensor. The MS5611-01BA can be interfaced to virtually any microcontroller. The communication protocol is simple, without the need of programming internal registers in the device. Small dimensions of only 5.0 mm x 3.0 mm and a height of 1.7 mm allow for integration in mobile devices. This new sensor module generation is based on leading MEMS technology and latest benefits from MEAS Switzerland proven experience and know-how in high volume manufacturing of altimeter modules, which have been widely used for over a decade. The sensing principle employed leads to very low hysteresis and high stability of both pressure and temperature signal. High resolution module, 10 cm Fast conversion down to 1 ms Low power, 1 µA (standby < 0.15 µA) QFN package 5.0 x 3.0 x 1.7 mm3 Supply voltage 1.8 to 3.6 V Integrated digital pressure sensor (24 bit ?? ADC) Operating range: 10 to 1200 mbar, -40 to +85 °C I2C and SPI interface up to 20 MHz No external components (Internal oscillator) Excellent long term stability; DATASHEET: http://www.meas-spec.com/downloads/MS5611-01BA01.pdf; LINK: http://www.meas-spec.com/product/t_product.aspx?id=8503#; MFGPN: MS5611-01BA; PARTNO: MS5611-01BA
U11 = pixhawk2:HMC5883L: Honeywell HMC5883L 12bit Magnetometer; PARTNO: HMC5883L
U12 = pixhawk2:L3G4200DH: L3G4200DH - Digital 3-axis Gyroscope The L3G4200DH is a low-power three-axis angular rate sensor. The L3G4200DH has a full scale of ±250/±500/ ±2000 dps and is capable of measuring rates with a user-selectable bandwidth. It can operate within a temperature range from -40 °C to +85 °C. Supply voltage: 2.4 V to 3.6 V. Full datasheet: L3G4200DH Datasheet <http://www.st.com/stonline/products/literature/ds/17300.pdf>; PARTNO: L3GD20
U13 = pixhawk2:SF-MICROSD; PARTNO: 114-00841-68
U14 = pixhawk2:MPU-6000: Invensense MPU-6000: 3-axis gyro, 3-axis accel & 9-axis MotionFusion The MPU-60X0 Motion Processing Unit (MPU?) is the world?s first motion processing solution with integrated 9-axis sensor fusion for handset and tablet applications, game controllers, motion pointer remote controls, and other consumer devices. The MPU-60X0 has an embedded 3-axis MEMS gyroscope, 3-axis MEMS accelerometer and Digital Motion Processor? (DMP) hardware accelerator engine with an auxiliary I 2 C port that interfaces to third party digital sensors, such as magnetometers. Interfacing with a 3-axis magnetometer delivers a complete 9-axis sensor fusion output to the MPU?s primary I 2 C or SPI port. (SPI is available on MPU-6000 only). This combines acceleration and rotational motion plus heading information into a single data stream for the application; DATASHEET: http://invensense.com/mems/gyro/documents/PS-MPU-6000A-00_v1.0.pdf; LINK: http://invensense.com/mems/gyro/mpu6000.html; MFGPN: MPU-6000; PARTNO: MPU-6000
U15 = pixhawk2:BMA280; PARTNO: *
U$1-U$4 = pixhawk2:MOUNT-HOLE; BOM: EXCLUDE; PARTNO: *
U$7 = pixhawk2:OSHW-LOGO: Open Source Hardware Logo This logo indicates the piece of hardware it is found on incorporates a OSHW license and/or adheres to the definition of open source hardware found here: http://freedomdefined.org/OSHW; BOM: EXCLUDE; PARTNO: *
X1 = pixhawk2:OSCILLATOR: Crystal Oscillator in 3.2x2.5 SMD; PARTNO: NX3225SA-24.000000MHZ

## Net classes
0 signal: width 0.203 mm, drill 0.3 mm, clearance 0.203 mm
1 power: width 0.254 mm, drill 0.3 mm, clearance 0.203 mm